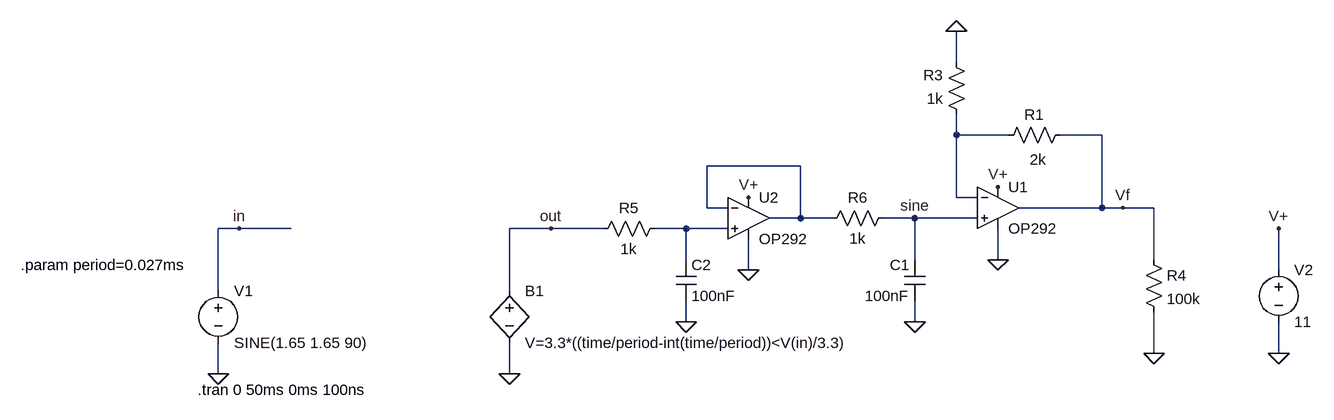
[diagram p0: schematic pwm_rc_series.asc]
pwm_rc_series.asc, the LTspice schematic file:
Version 4
SHEET 1 1964 680
WIRE 1072 -384 1072 -432
WIRE 1072 -272 1072 -304
WIRE 1152 -272 1072 -272
WIRE 1296 -272 1232 -272
WIRE 832 -224 688 -224
WIRE 1072 -176 1072 -272
WIRE 1104 -176 1072 -176
WIRE 688 -160 688 -224
WIRE 720 -160 688 -160
WIRE 1296 -160 1296 -272
WIRE 1296 -160 1168 -160
WIRE 1328 -160 1296 -160
WIRE 1376 -160 1328 -160
WIRE 832 -144 832 -224
WIRE 832 -144 784 -144
WIRE 880 -144 832 -144
WIRE 1008 -144 960 -144
WIRE 1104 -144 1008 -144
WIRE -32 -128 -64 -128
WIRE 48 -128 -32 -128
WIRE 448 -128 384 -128
WIRE 528 -128 448 -128
WIRE 656 -128 608 -128
WIRE 720 -128 656 -128
WIRE 656 -80 656 -128
WIRE 1008 -80 1008 -144
WIRE 1136 -80 1136 -128
WIRE 1376 -80 1376 -160
WIRE 752 -64 752 -112
WIRE 1568 -64 1568 -128
WIRE -64 -32 -64 -128
WIRE 384 -32 384 -128
WIRE 656 16 656 -16
WIRE 1008 16 1008 -16
WIRE 1376 64 1376 0
WIRE 1568 64 1568 16
WIRE -64 96 -64 48
WIRE 384 96 384 48
FLAG -64 96 0
FLAG 384 96 0
FLAG -32 -128 in
FLAG 448 -128 out
FLAG 1008 -144 sine
FLAG 1136 -80 0
FLAG 1568 64 0
FLAG 1568 -128 V+
FLAG 1136 -192 V+
FLAG 1072 -432 0
FLAG 1328 -160 Vf
FLAG 1376 64 0
FLAG 656 16 0
FLAG 752 -176 V+
FLAG 752 -64 0
FLAG 1008 16 0
SYMBOL voltage -64 -48 R0
WINDOW 123 0 0 Left 0
WINDOW 39 0 0 Left 0
SYMATTR InstName V1
SYMATTR Value SINE(1.65 1.65 90)
SYMBOL bv 384 -48 R0
SYMATTR InstName B1
SYMATTR Value V=3.3*((time/period-int(time/period))<V(in)/3.3)
SYMBOL OpAmps\\OP292 1136 -224 R0
SYMATTR InstName U1
SYMBOL voltage 1568 -80 R0
WINDOW 123 0 0 Left 0
WINDOW 39 0 0 Left 0
SYMATTR InstName V2
SYMATTR Value 11
SYMBOL res 1088 -288 R180
WINDOW 0 36 76 Left 2
WINDOW 3 36 40 Left 2
SYMATTR InstName R3
SYMATTR Value 1k
SYMBOL res 1360 -96 R0
SYMATTR InstName R4
SYMATTR Value 100k
SYMBOL OpAmps\\OP292 752 -208 R0
SYMATTR InstName U2
SYMBOL res 624 -144 R90
WINDOW 0 0 56 VBottom 2
WINDOW 3 32 56 VTop 2
SYMATTR InstName R5
SYMATTR Value 1k
SYMBOL res 976 -160 R90
WINDOW 0 0 56 VBottom 2
WINDOW 3 32 56 VTop 2
SYMATTR InstName R6
SYMATTR Value 1k
SYMBOL cap 640 -80 R0
SYMATTR InstName C2
SYMATTR Value 100nF
SYMBOL cap 1024 -16 R180
WINDOW 0 24 56 Left 2
WINDOW 3 24 8 Left 2
SYMATTR InstName C1
SYMATTR Value 100nF
SYMBOL res 1248 -288 R90
WINDOW 0 0 56 VBottom 2
WINDOW 3 38 50 VTop 2
SYMATTR InstName R1
SYMATTR Value 2k
TEXT -96 120 Left 2 !.tran 0 50ms 0ms 100ns
TEXT -368 -72 Left 2 !.param period=0.027ms

The netlist it stands for:
* pwm_rc_series.asc
V1 in 0 SINE(1.65 1.65 90)
B1 out 0 V=3.3*((time/period-int(time/period))<V(in)/3.3)
XU1 sine N001 V+ 0 Vf OP292  ; pins In+ In- V+ V- OUT
V2 V+ 0 11
R3 N001 0 1k
R4 Vf 0 100k
XU2 N003 N002 V+ 0 N002 OP292  ; pins In+ In- V+ V- OUT
R5 N003 out 1k
R6 sine N002 1k
C2 N003 0 100nF
C1 0 sine 100nF
R1 Vf N001 2k
.tran 0 50ms 0ms 100ns
.param period=0.027ms
.lib ADI1.lib
.backanno
.end